# EAGLE design RS232v20 (EAGLE 9.7.0)
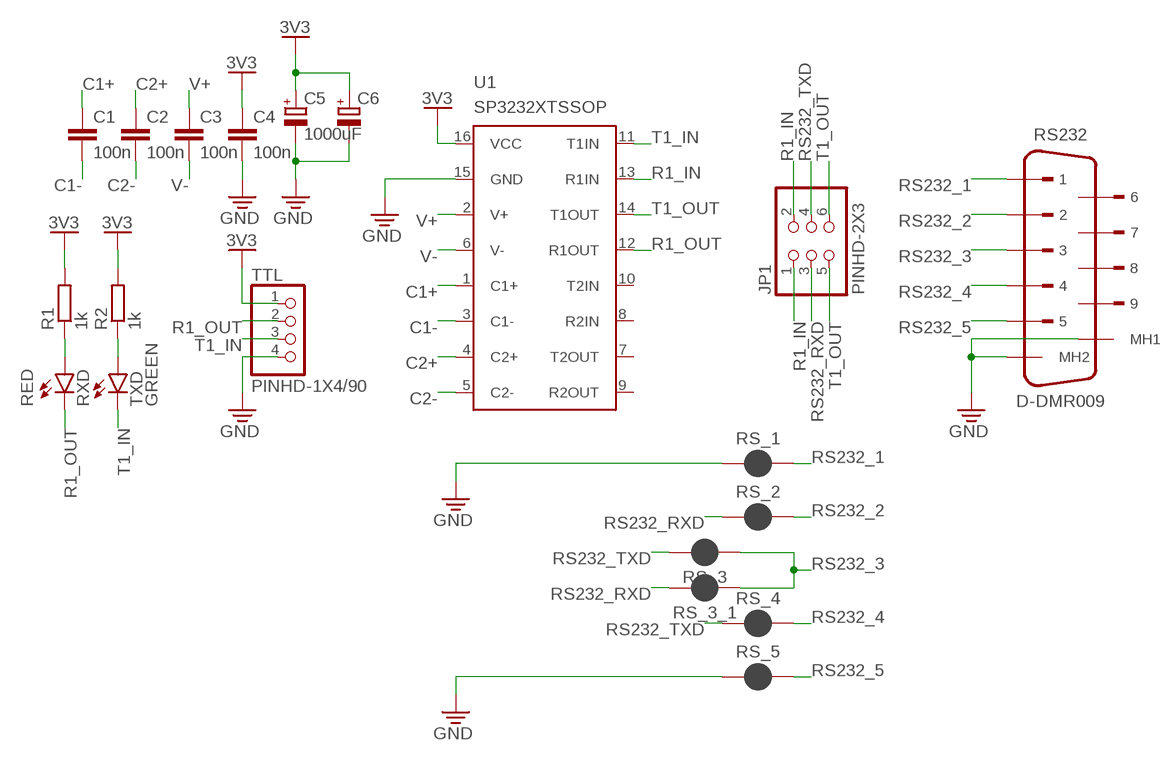
[diagram p0: schematic, sheet 1]

## Parts
C1  100n  C-EUC0402  [C0402]
C2  100n  C-EUC0402  [C0402]
C3  100n  C-EUC0402  [C0402]
C4  100n  C-EUC0402  [C0402]
C5  1000uF  CPOL-EU140CLH-1010  [140CLH-1010]
C6  C-POL_RADIAL-11MM-DIA  [CAPPRD508W65D1000H1100B]
JP1  PINHD-2X3  [2X03]
R1  1k  R-EU_R0402  [R0402]
R2  1k  R-EU_R0402  [R0402]
RS232  D-DMR009  5747840"  [5747840-4]
RS_1  JUMPER-SMT_2_NC_PASTE_SILK  [SMT-JUMPER_2_NC_PASTE_SILK]
RS_2  JUMPER-SMT_2_NC_PASTE_SILK  [SMT-JUMPER_2_NC_PASTE_SILK]
RS_3  JUMPER-SMT_2_NC_PASTE_SILK  [SMT-JUMPER_2_NC_PASTE_SILK]
RS_3_1  JUMPER-SMT_2_NC_PASTE_SILK  [SMT-JUMPER_2_NC_PASTE_SILK]
RS_4  JUMPER-SMT_2_NC_PASTE_SILK  [SMT-JUMPER_2_NC_PASTE_SILK]
RS_5  JUMPER-SMT_2_NC_PASTE_SILK  [SMT-JUMPER_2_NC_PASTE_SILK]
RXD  RED  LEDCHIP-LED0603  [CHIP-LED0603]
TTL  PINHD-1X4/90  [1X04/90]
TXD  GREEN  LEDCHIP-LED0603  [CHIP-LED0603]
U1  SP3232XTSSOP  [TSSOP16]

## Nets
3V3: C4.1 C5.+ C6.1(+) R1.2 R2.2 TTL.1 U1.16(VCC)
C1+: C1.1 U1.1(C1+)
C1-: C1.2 U1.3(C1-)
C2+: C2.1 U1.4(C2+)
C2-: C2.2 U1.5(C2-)
GND: C4.2 C5.- C6.2(-) RS232.MH1(MH2) RS232.MH2(MH1) RS_1.1 RS_5.1 TTL.4 U1.15(GND)
N$1: R1.1 RXD.A
N$2: R2.1 TXD.A
R1_IN: JP1.1 JP1.2 U1.13(R1IN)
R1_OUT: RXD.C TTL.2 U1.12(R1OUT)
RS232_1: RS232.1 RS_1.2
RS232_2: RS232.2 RS_2.2
RS232_3: RS232.3 RS_3.1 RS_3_1.1
RS232_4: RS232.4 RS_4.2
RS232_5: RS232.5 RS_5.2
RS232_RXD: JP1.3 RS_2.1 RS_3_1.2
RS232_TXD: JP1.4 RS_3.2 RS_4.1
T1_IN: TTL.3 TXD.C U1.11(T1IN)
T1_OUT: JP1.5 JP1.6 U1.14(T1OUT)
V+: C3.1 U1.2(V+)
V-: C3.2 U1.6(V-)
Unconnected: RS232.6 RS232.7 RS232.8 RS232.9 U1.7(T2OUT) U1.8(R2IN) U1.9(R2OUT) U1.10(T2IN)

## Library data of the parts
C1-C4 = rcl:C-EU: CAPACITOR, European symbol; SPICEPREFIX: C
C5 = rcl:CPOL-EU: POLARIZED CAPACITOR, European symbol; SPICEPREFIX: C
C6 = Capacitor:C-POL: Capacitor Polarised - Generic; CATEGORY: Capacitor
JP1 = Connector:PINHD-2X3: PIN HEADER; CATEGORY: Headers; DESCRIPTION: Header, Straight, 2x3 Position; MANUFACTURER: Generic; MPN: Generic; OPERATING_TEMPERATURE: Generic; PART_STATUS: Active; PITCH: 0.100" (2.54mm); ROHS_COMPLIANCE: Generic; SERIES: Generic; SUB-CATEGORY: Headers, Male Pins; TYPE: Board to Board or Cable, Unshrouded, Through Hole, Straight
R1 R2 = rcl:R-EU_: RESISTOR, European symbol; SPICEPREFIX: R
RS232 = Connector_D-Sub:5747840: D-SUB, 9POS, PLUG, R/A SLDR Datasheet <https://www.te.com/commerce/DocumentDelivery/DDEController?Action=showdoc&DocId=Catalog+Section%7F82068_AMPLIMITE_Right-Angle_Posted_Conn%7F0412%7Fpdf%7FEnglish%7FENG_CS_82068_AMPLIMITE_Right-Angle_Posted_Conn_0412.pdf%7F5747840-4>; CATEGORY: Connector; DESCRIPTION: PCB D-Sub Connectors, Receptacle, Board-to-Board, 9 Position, 2.74mm [.108in] Centerline, 2 Row, Row-to-Row Spacing 2.84 mm [.112 in]; GENDER: Male; MANUFACTURER: TE Connectivity; MPN: 5747840-4; OPERATING_TEMP: -55°C to +105 °C; PART_STATUS: Active; ROHS_COMPLIANT: RoHS Compliant; SERIES: AMPLIMITE HD-20; SUB-CATEGORY: D-SUB; TYPE: R/A
RS_1-RS_3 RS_3_1 RS_4 RS_5 = SparkFun-Jumpers:JUMPER-SMT_2_NC_PASTE: Normally closed solder jumper This jumper has an aperture in the stencil to allow solder paste to bridge the split in the wire so it's normally closed (NC). Wick off the solder to open the connection. Reapply solder to reclose the connection.
RXD TXD = led:LED: LED OSRAM: - CHIPLED LG R971, LG N971, LY N971, LG Q971, LY Q971, LO R971, LY R971 LH N974, LH R974 LS Q976, LO Q976, LY Q976 LO Q996 - Hyper CHIPLED LW Q18S LB Q993, LB Q99A, LB R99A - SideLED LS A670, LO A670, LY A670, LG A670, LP A670 LB A673, LV A673, LT A673, LW A673 LH A674 LY A675 LS A676, LA A676, LO A676, LY A676, LW A676 LS A679, LY A679, LG A679 - Hyper Micro SIDELED® LS Y876, LA Y876, LO Y876, LY Y876 LT Y87S - SmartLED LW L88C, LW L88S LB L89C, LB L89S, LG L890 LS L89K, LO L89K, LY L89K LS L896, LA L896, LO L896, LY L896 - TOPLED LS T670, LO T670, LY T670, LG T670, LP T670 LSG T670, LSP T670, LSY T670, LOP T670, LYG T670 LG T671, LOG T671, LSG T671 LB T673, LV T673, LT T673, LW T673 LH T674 LS T676, LA T676, LO T676, LY T676, LB T676, LH T676, LSB T676, LW T676 LB T67C, LV T67C, LT T67C, LS T67K, LO T67K, LY T67K, LW E67C LS E67B, LA E67B, LO E67B, LY E67B, LB E67C, LV E67C, LT E67C LW T67C LS T679, LY T679, LG T679 LS T770, LO T770, LY T770, LG T770, LP T770 LB T773, LV T773, LT T773, LW T773 LH T774 LS E675, LA E675, LY E675, LS T675 LS T776, LA T776, LO T776, LY T776, LB T776 LHGB T686 LT T68C, LB T68C - Hyper Mini TOPLED® LB M676 - Mini TOPLED Santana® LG M470 LS M47K, LO M47K, LY M47K Source: http://www.osram.convergy.de LUXEON: - LUMILED® LXK2-PW12-R00, LXK2-PW12-S00, LXK2-PW14-U00, LXK2-PW14-V00 LXK2-PM12-R00, LXK2-PM12-S00, LXK2-PM14-U00 LXK2-PE12-Q00, LXK2-PE12-R00, LXK2-PE12-S00, LXK2-PE14-T00, LXK2-PE14-U00 LXK2-PB12-K00, LXK2-PB12-L00, LXK2-PB12-M00, LXK2-PB14-N00, LXK2-PB14-P00, LXK2-PB14-Q00 LXK2-PR12-L00, LXK2-PR12-M00, LXK2-PR14-Q00, LXK2-PR14-R00 LXK2-PD12-Q00, LXK2-PD12-R00, LXK2-PD12-S00 LXK2-PH12-R00, LXK2-PH12-S00 LXK2-PL12-P00, LXK2-PL12-Q00, LXK2-PL12-R00 Source: www.luxeon.com KINGBRIGHT: KA-3528ASYC Source: www.kingbright.com
TTL = Connector:PINHD-1X4: PIN HEADER; CATEGORY: Headers; DESCRIPTION: Header, Right Angle, 4 Position; MANUFACTURER: Generic; MPN: Generic; OPERATING_TEMPERATURE: Generic; PART_STATUS: Active; PITCH: 0.100" (2.54mm); ROHS_COMPLIANCE: Generic; SERIES: Generic; SUB-CATEGORY: Headers, Male Pins; TYPE: Board to Board or Cable, Unshrouded, Through Hole, Right Angle
U1 = SP3232EEY-L:SP3232X: TSSOP16 package for SP3232EEY-L/TR. It could be used with other Exar SP3232 parts with the same package, but it's up to you to check for pinout and spacing. Datasheet <https://www.exar.com/ds/sp3222e_sp3232e.pdf> is available through https://www.exar.com/ds/sp3222e_sp3232e.pdf

## Board
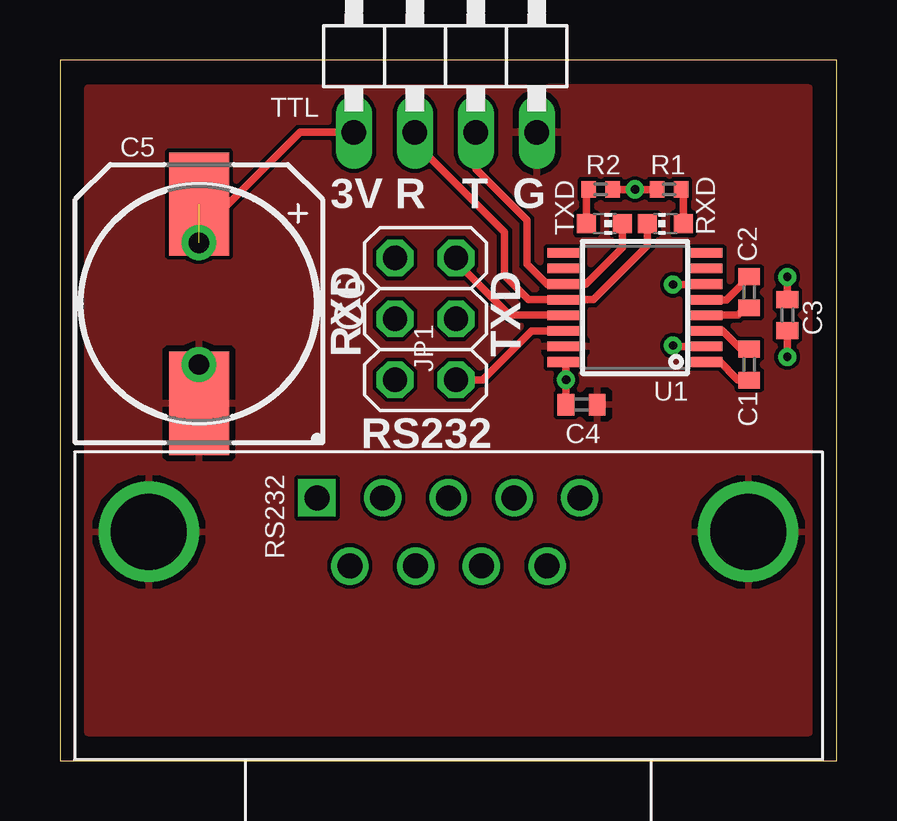
[diagram p1: board, top side]
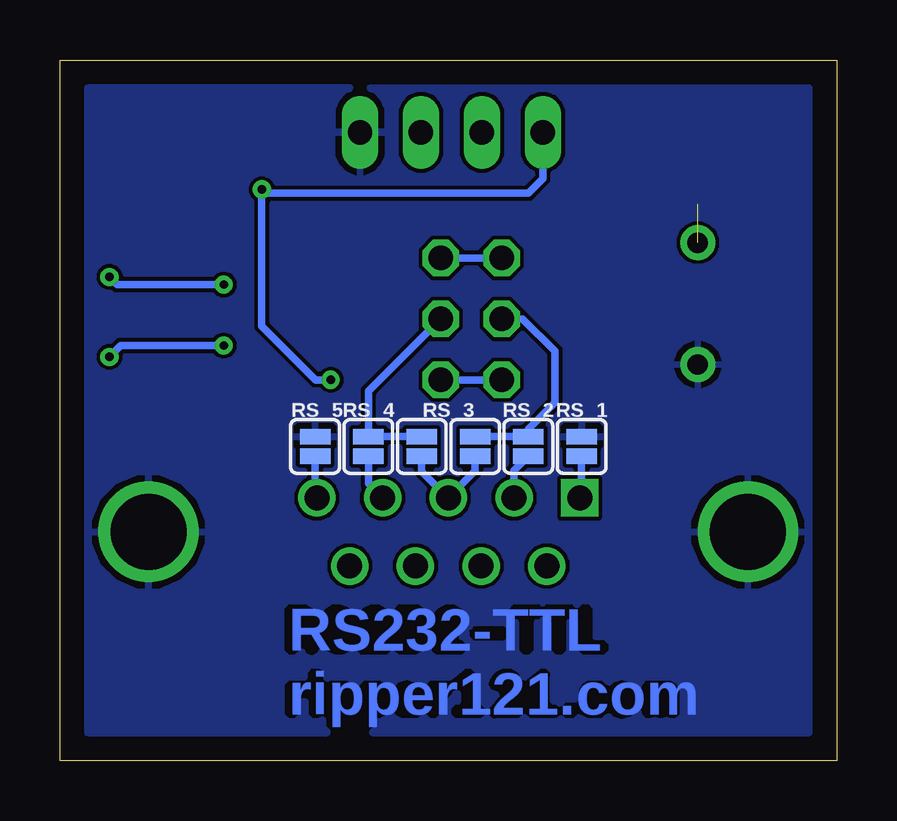
[diagram p2: board, bottom side, seen from below]

Size 32.38 x 29.21 mm. Coordinates in mm from the lower left corner, seen from the top.
Outline: 0,0 32.38,0 32.38,29.21 0,29.2 0,0
Copper layers (1*16): Top / Bottom
Stack-up Default Layer Stack: Top User Defined 0.035mm / Dielectric-1 User Defined 1.5mm / Bottom User Defined 0.035mm
Design rules: minimum copper width 6mil, minimum drill size 0.35mm, copper clearance wire_polygon to wire_polygon 6mil, copper clearance wire_polygon to pad_smd 6mil, copper clearance wire_polygon to via 6mil, copper clearance pad_smd to pad_smd 6mil, copper clearance pad_smd to via 6mil, copper clearance via to via 6mil, copper clearance smd to pad (same net) 6mil, copper clearance smd to via (same net) 6mil, copper clearance smd to smd (same net) 6mil, dimension clearance 40mil, restrict clearance 0mil, drill distance 6mil, keepout clearance 0mil

### Footprints (pad centres in the part's own frame; a part is rotated, then mirrored left to right if it is on the bottom)
C0402 = smd 0.7 x 0.9: 1 -0.65,0; 2 0.65,0
140CLH-1010 = smd 4.3 x 2.5: + 4.15,0; - -4.15,0
CAPPRD508W65D1000H1100B = drill 0.85 pad 1.45: 1 -2.54,0; 2 2.54,0
2X03 = drill 1.016 octagon: 1 -2.54,-1.27; 2 -2.54,1.27; 3 0,-1.27; 4 0,1.27; 5 2.54,-1.27; 6 2.54,1.27
R0402 = smd 0.6 x 0.7: 1 -0.5,0; 2 0.5,0
5747840-4 = drill 1.04 square: 1 0,0 | drill 1.04: 2 2.74,0; 3 5.48,0; 4 8.22,0; 5 10.96,0; 6 1.37,-2.84; 7 4.11,-2.84; 8 6.85,-2.84; 9 9.59,-2.84 | drill 3.17: MH1 -7.01,-1.42; MH2 17.98,-1.42
SMT-JUMPER_2_NC_PASTE_SILK = smd 0.635 x 1.27: 1 -0.406,0; 2 0.406,0
CHIP-LED0603 = smd 0.8 x 0.8: A 0,-0.75; C 0,0.75
1X04/90 = drill 1.016 long: 1 -3.81,-3.81; 2 -1.27,-3.81; 3 1.27,-3.81; 4 3.81,-3.81
TSSOP16 = smd 0.4 x 1.5: 1 -2.275,-2.9; 2 -1.625,-2.9; 3 -0.975,-2.9; 4 -0.325,-2.9; 5 0.325,-2.9; 6 0.975,-2.9; 7 1.625,-2.9; 8 2.275,-2.9; 9 2.275,2.9; 10 1.625,2.9; 11 0.975,2.9; 12 0.325,2.9; 13 -0.325,2.9; 14 -0.975,2.9; 15 -1.625,2.9; 16 -2.275,2.9

### Placement (x,y rotation side)
C1  28.73,16.51 90 top
C2  28.73,19.53 90 top
C3  30.32,18.57 90 top
C4  21.75,14.84 0 top
C5  5.79,19.05 90 top
C6  5.79,19.05 270 top
JP1  15.24,18.41 270 top
R1  25.4,23.81 180 top
R2  22.54,23.81 0 top
RS232  10.72,10.95 0 top
RS_1  10.64,13.1 270 bottom
RS_2  12.86,13.1 270 bottom
RS_3  17.3,13.1 90 bottom
RS_3_1  15.07,13.1 90 bottom
RS_4  19.53,13.1 270 bottom
RS_5  21.75,13.1 270 bottom
RXD  25.24,22.38 90 top
TTL  16.07,30 0 top
TXD  22.7,22.38 270 top
U1  23.97,18.89 90 top

### Tracks (layer width: path | path; a pad name or v marks a point on that pad's centre or on a via)
3V3  (via drill 0.35)  (1 unrouted)
  Top 0.305: R2.2 v23.97,23.81 R1.2 | C5.+ 5.82,23.18 6.99,23.18 10,26.19 TTL.1 | C4.1 v21.1,15.88 21.1,16.59 U1.16
  Bottom 0.305: v21.1,15.88 21.73,15.88 23.97,18.11 v23.97,23.81 23.81,23.65 12.86,23.65 12.26,24.26 TTL.1
C1+
  Top 0.305: U1.1 26.92,16.67 27.46,16.67 28.26,15.88 28.72,15.88 C1.1
C1-
  Top 0.305: U1.3 26.89,17.94 27.62,17.94 28.42,17.14 28.72,17.14 C1.2
C2+
  Top 0.305: C2.1 28.65,18.96 28.26,18.57 U1.4
C2-
  Top 0.305: C2.2 28.73,20.16 27.78,19.21 26.88,19.21 U1.5
GND
  pour Bottom: 0,0 33.02,0 33.02,29.21 0,29.21
  pour Top: 0,0 0,29.21 33.02,29.21 33.02,0
N$1
  Top 0.305: RXD.A 25.99,23.72 R1.1
N$2
  Top 0.305: TXD.A 21.95,23.72 R2.1
R1_IN
  Top 0.305: U1.13 18.74,18.57 16.51,20.8 JP1.2
  Bottom 0.305: JP1.1 JP1.2
R1_OUT
  Top 0.305: RXD.C 24.49,21.48 22.23,19.22 U1.12 19.53,19.22 18.53,20.22 18.53,22.03 14.8,25.77 TTL.2
RS232_1
  Bottom 0.305: RS_1.2 10.64,11.03 RS232.1
RS232_2
  Bottom 0.305: RS232.2 13.46,12.09 RS_2.2
RS232_3
  Bottom 0.305: RS232.3 | RS232.3 15.07,12.07 RS_3_1.1 | RS232.3 17.3,12.06 RS_3.1
RS232_4
  Bottom 0.305: RS_4.2 19.53,11.54 RS232.4
RS232_5
  Bottom 0.305: RS_5.2 21.75,11.03 RS232.5
RS232_RXD
  Bottom 0.305: RS_3_1.2 RS_2.1 12.86,13.82 11.75,14.93 11.75,17.07 13.1,18.41 JP1.3
RS232_TXD
  Bottom 0.305: RS_3.2 RS_4.1 19.53,15.4 JP1.4
T1_IN
  Top 0.305: TXD.C 23.45,21.39 21.93,19.87 U1.11 21.05,19.84 20.32,19.84 19.46,20.7 19.46,22.54 17.34,24.67 TTL.3
T1_OUT
  Top 0.305: U1.14 19.66,17.92 17.62,15.88 JP1.6
  Bottom 0.305: JP1.5 JP1.6
V+  (via drill 0.35)
  Top 0.305: U1.2 25.6,17.27 v25.56,17.3 | v30.32,16.83 C3.1
  Bottom 0.305: v25.56,17.3 29.84,17.3 v30.32,16.83
V-  (via drill 0.35)
  Top 0.305: U1.6 26.85,19.84 v25.56,19.84 | v30.32,20.16 C3.2
  Bottom 0.305: v30.32,20.16 30,19.84 v25.56,19.84

### Text on the board
Bottom: RS232-TTL / ripper121.com
NamesTop: 3V R T G | RXD | TXD | RS232
SolderMaskBottom: RS232-TTL / ripper121.com